# Altium schematic sheet Sheet4.SchDoc
size A4; SheetNumber: 3; SheetTotal: 3
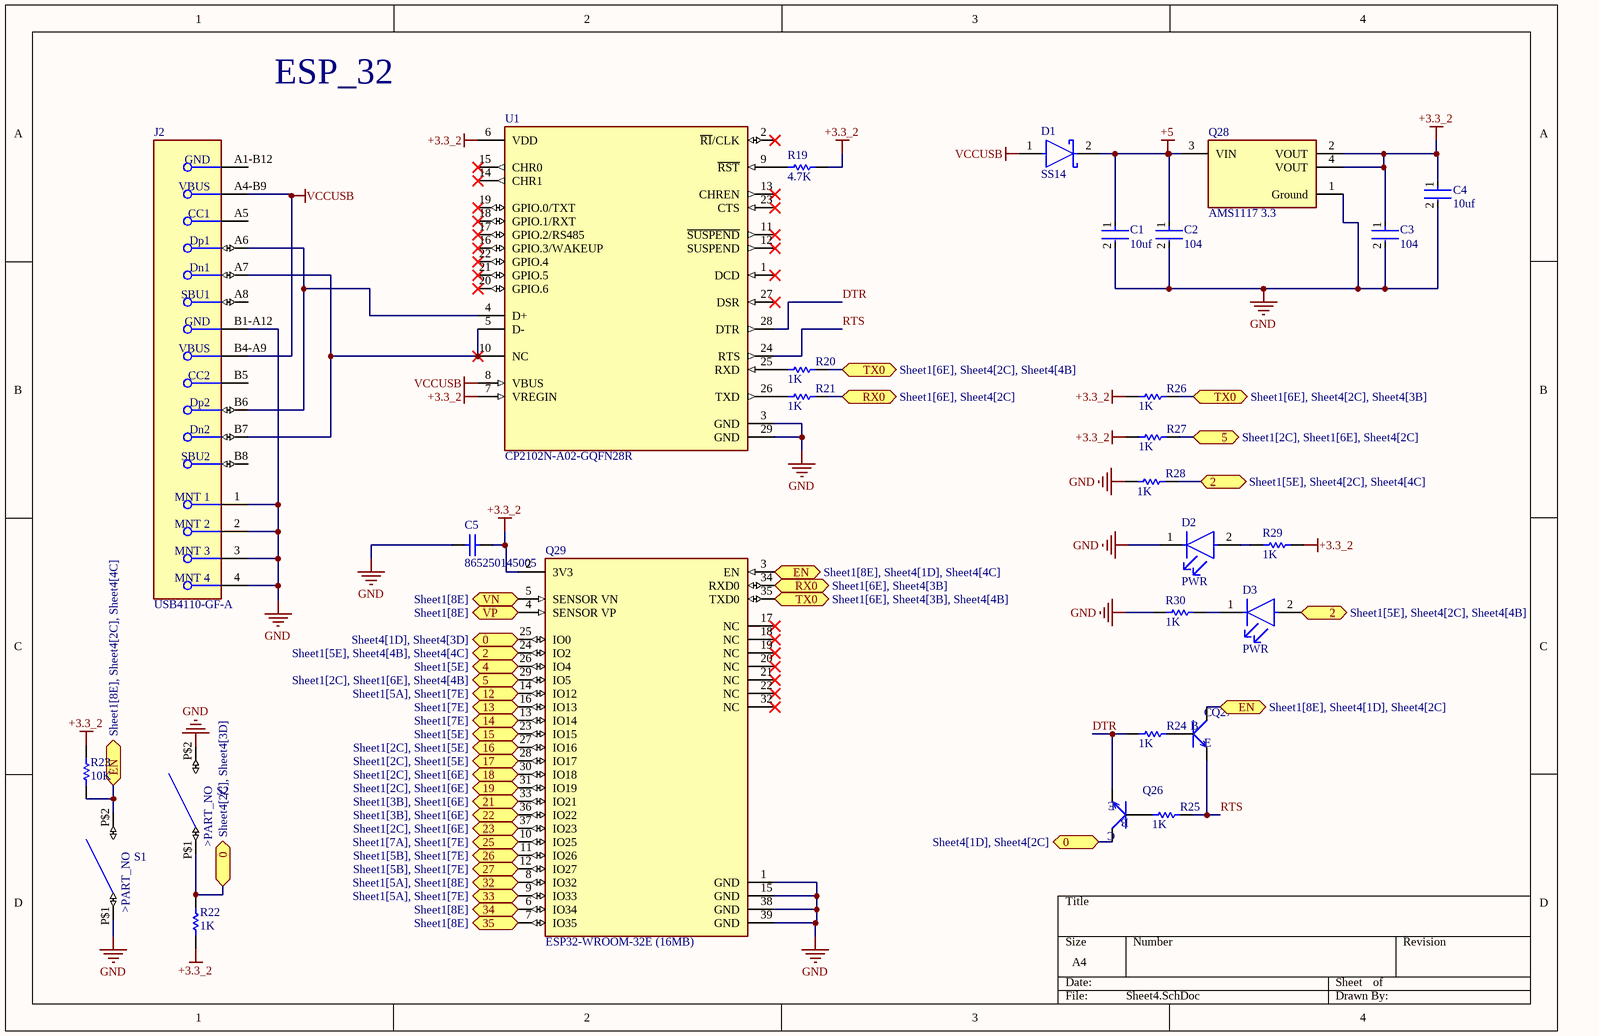
[diagram p0: Sheet4.SchDoc]

## Parts
C1  10uf  [FP-GRM21B-0_1-MFG]
C2  104  [FP-GRM21B-0_1-MFG]
C3  104  [FP-GRM21B-0_1-MFG]
C4  10uf  [FP-GRM21B-0_1-MFG]
C5  865250145005  [WCAP-ASNP_D6.3H7.7]
D1  SS14  [FP-403AE-MFG]
D2  PWR  [FP-KP-2012QBC-D-MFG]
D3  PWR  [FP-KP-2012QBC-D-MFG]
J2  USB4110-GF-A  [FP-USB4110-GF-A-MFG]
Q26  SMD-TRANSISTORS-NPN-25V-500MW(SOT-23)  [SOT-23]  (value not drawn)
Q27  SMD-TRANSISTORS-NPN-25V-500MW(SOT-23)  [SOT-23]  (value not drawn)
Q28  AMS1117 3.3  [FP-AMS1117-IPC_A]
Q29  ESP32-WROOM-32E (16MB)  [FP-ESP32-WROOM-32E_16MB-MFG]
R19  4.7K  [RESC2013X70X40NL20T20]
R20  1K  [RESC2013X70X40NL20T20]
R21  1K  [RESC2013X70X40NL20T20]
R22  1K  [RESC2013X70X40NL20T20]
R23  10K  [RESC2013X70X40NL20T20]
R24  1K  [RESC2013X70X40NL20T20]
R25  1K  [RESC2013X70X40NL20T20]
R26  1K  [RESC2013X70X40NL20T20]
R27  1K  [RESC2013X70X40NL20T20]
R28  1K  [RESC2013X70X40NL20T20]
R29  1K  [RESC2013X70X40NL20T20]
R30  1K  [RESC2013X70X40NL20T20]
S1  PTS636SP43SMTRLFS  [PTS636SP43SMTRLFS]  (value not drawn)
S2  PTS636SP43SMTRLFS  [PTS636SP43SMTRLFS]  (value not drawn)
U1  CP2102N-A02-GQFN28R  [FP-CP2102N-A02-GQFN28R-IPC_B]

## Ports
0 (bidir, see Sheet4[1D], Sheet4[2C]), 0 (bidir, see Sheet4[1D], Sheet4[3D]), 0 (bidir, see Sheet4[2C], Sheet4[3D]), 2 (bidir, see Sheet1[5E], Sheet4[2C], Sheet4[4B]), 2 (bidir, see Sheet1[5E], Sheet4[2C], Sheet4[4C]), 2 (bidir, see Sheet1[5E], Sheet4[4B], Sheet4[4C]), 4 (bidir, see Sheet1[5E]), 5 (bidir, see Sheet1[2C], Sheet1[6E], Sheet4[2C]), 5 (bidir, see Sheet1[2C], Sheet1[6E], Sheet4[4B]), 12 (bidir, see Sheet1[5A], Sheet1[7E]), 13 (bidir, see Sheet1[7E]), 14 (bidir, see Sheet1[7E]), 15 (bidir, see Sheet1[5E]), 16 (bidir, see Sheet1[2C], Sheet1[5E]), 17 (bidir, see Sheet1[2C], Sheet1[5E]), 18 (bidir, see Sheet1[2C], Sheet1[6E]), 19 (bidir, see Sheet1[2C], Sheet1[6E]), 21 (bidir, see Sheet1[3B], Sheet1[6E]), 22 (bidir, see Sheet1[3B], Sheet1[6E]), 23 (bidir, see Sheet1[2C], Sheet1[6E]), 25 (bidir, see Sheet1[7A], Sheet1[7E]), 26 (bidir, see Sheet1[5B], Sheet1[7E]), 27 (bidir, see Sheet1[5B], Sheet1[7E]), 32 (bidir, see Sheet1[5A], Sheet1[8E]), 33 (bidir, see Sheet1[5A], Sheet1[7E]), 34 (bidir, see Sheet1[8E]), 35 (bidir, see Sheet1[8E]), EN (bidir, see Sheet1[8E], Sheet4[1D], Sheet4[2C]), EN (bidir, see Sheet1[8E], Sheet4[1D], Sheet4[4C]), EN (bidir, see Sheet1[8E], Sheet4[2C], Sheet4[4C]), RX0 (bidir, see Sheet1[6E], Sheet4[2C]), RX0 (bidir, see Sheet1[6E], Sheet4[3B]), TX0 (bidir, see Sheet1[6E], Sheet4[2C], Sheet4[3B]), TX0 (bidir, see Sheet1[6E], Sheet4[2C], Sheet4[4B]), TX0 (bidir, see Sheet1[6E], Sheet4[3B], Sheet4[4B]), VN (bidir, see Sheet1[8E]), VP (bidir, see Sheet1[8E])

## Nets
+3.3_2: C3.1 C4.1 C5.2 Q28.2(VOUT) Q28.4(VOUT) Q29.2(3V3) R19.1 R22.2 R23.1 R26.2 R27.2 R29.2 U1.6(VDD) U1.7(VREGIN)
+5: C1.1 C2.1 D1.2(C) Q28.3(VIN)
GND: C1.2 C2.2 C3.2 C4.2 C5.1 D2.1(C) J2.1(MNT_1) J2.2(MNT_2) J2.3(MNT_3) J2.4(MNT_4) J2.B1-A12(GND) Q28.1(Ground) Q29.1(GND) Q29.15(GND) Q29.38(GND) Q29.39(GND) R28.2 R30.1 S1.P$1 S2.P$2 U1.3(GND) U1.29(GND)
VCCUSB: D1.1(A) J2.A4-B9(VBUS) J2.B4-A9(VBUS) U1.8(VBUS)
0: Q26.3(C) Q29.25(IO0) R22.1 S2.P$1 ; port 0
2: D3.2(A) Q29.24(IO2) R28.1 ; port 2
4: Q29.26(IO4) ; port 4
5: Q29.29(IO5) R27.1 ; port 5
12: Q29.14(IO12) ; port 12
13: Q29.16(IO13) ; port 13
14: Q29.13(IO14) ; port 14
15: Q29.23(IO15) ; port 15
16: Q29.27(IO16) ; port 16
17: Q29.28(IO17) ; port 17
18: Q29.30(IO18) ; port 18
19: Q29.31(IO19) ; port 19
21: Q29.33(IO21) ; port 21
22: Q29.36(IO22) ; port 22
23: Q29.37(IO23) ; port 23
25: Q29.10(IO25) ; port 25
26: Q29.11(IO26) ; port 26
27: Q29.12(IO27) ; port 27
32: Q29.8(IO32) ; port 32
33: Q29.9(IO33) ; port 33
34: Q29.6(IO34) ; port 34
35: Q29.7(IO35) ; port 35
DTR: Q26.2(E) R24.2 U1.28(DTR)
EN: Q27.3(C) Q29.3(EN) R23.2 S1.P$2 ; port EN
RTS: Q27.2(E) R25.1 U1.24(RTS)
RX0: Q29.34(RXD0) R21.1 ; port RX0
TX0: Q29.35(TXD0) R20.1 R26.1 ; port TX0
VN: Q29.5(SENSOR_VN) ; port VN
VP: Q29.4(SENSOR_VP) ; port VP
NetD2_2: D2.2(A) R29.1
NetD3_1: D3.1(C) R30.2
NetJ2_A6: J2.A6(Dp1) J2.B6(Dp2) U1.4(D+)
NetJ2_A7: J2.A7(Dn1) J2.B7(Dn2) U1.5(D-) U1.10(NC)
NetQ26_1: Q26.1(B) R25.2
NetQ27_1: Q27.1(B) R24.1
NetR19_2: R19.2 U1.9(~{RST})
NetR20_2: R20.2 U1.25(RXD)
NetR21_2: R21.2 U1.26(TXD)

Not connected (* = marked no-connect by the designer): J2 A1-B12(GND) A5(CC1) A8(SBU1) B5(CC2) B8(SBU2); Q29 17(NC)* 18(NC)* 19(NC)* 20(NC)* 21(NC)* 22(NC)* 32(NC)*; U1 1(DCD)* 2(~{RI}/CLK)* 11(~{SUSPEND})* 12(SUSPEND)* 13(CHREN)* 14(CHR1)* 15(CHR0)* 16(GPIO.3/WAKEUP)* 17(GPIO.2/RS485)* 18(GPIO.1/RXT)* 19(GPIO.0/TXT)* 20(GPIO.6)* 21(GPIO.5)* 22(GPIO.4)* 23(CTS)* 27(DSR)*

## Notes on the sheet
- ESP_32
- (in symbol PTS636SP43SMTRLFS) >PART_NO

## Library data of the parts
C1-C4 = CMP-2007-03453-2: Chip Multilayer Ceramic Capacitors for General Purpose, 0805, 10uF, X5R, 15%, 10%, 16V; Radiation Hardening: No; Thickness: 0.053inch; Voltage Rating (DC): 16V; Lead Free: Lead Free; Package Quantity: 1; Width: 1.25mm; Case Code (Imperial): 0805; Depth: 1.25mm; Packaging: Tape and Reel; Dielectric: X5R; Max Operating Temperature: 85°C; Tolerance: 10%; Voltage Rating: 16V; Voltage: 16V; Capacitance: 10uF; Height: 1.25mm; Case Code (Metric): 2012; Material: Ceramic; Mount: Surface Mount; Case/Package: 0805; REACH SVHC: No SVHC; Length: 2mm; Min Operating Temperature: -55°C; Termination: SMD/SMT
C5 = CMP-03913-53758703-1: 865250145005 SMD Aluminium Electrolytic Capacitor, WCAP-ASNP Series, 100 F, 6.3 V, Radial Can - SMD, 6.3 mm; Impedance: 463.097mΩ; Ripple Current (AC): 65mA; Life (Hours): 2000hours; Voltage Rating: 6.3V; Insulation Resistance: 1MΩ; Tolerance: 20%; Capacitance: 100µF; Polarity: Polar; Leakage Current: 31.5µA; Width: 6.6mm; Height - Seated (Max): 7.6962mm; RoHS: Compliant; REACH SVHC: Unknown; Length: 7.7mm; Max Operating Temperature: 85°C; Case/Package: Radial; Diameter: 6.3mm; NexarPartId: 53758703; Min Operating Temperature: -40°C; Ripple Current: 65mA; Mount: Surface Mount; Packaging: Tape & Reel (TR); Voltage Rating (DC): 6.3V; Height: 7.7mm
D1 = CMP-2000-04943-2: DIODE SCHOTTKY 40V 1A SMA; Manufacturer: ON Semiconductor; Peak Reverse Current: 0.2mA; Max Junction Temp: +125°C; Standoff Height: 0.05mm; Max Surge Forward Current: 40A; Mouser Description: Schottky Diodes & Rectifiers SMA 40V 1.0A; RoHS: TRUE; Lead Free: Yes; Manufacturer Part Number: SS14; Device Class L3: Schottky Diodes; Category: Diode; Automotive: No; Digikey Description: DIODE SCHOTTKY 40V 1A SMA; ComponentLink2Description: Datasheet; Device Class L2: Diodes; Height: 2.5mm; Temperature Range High: +125°C; ComponentLink2URL: https://www.onsemi.com/pub/Collateral/SS19-D.PDF; Device Class L1: Discrete Semiconductors; Package: 403AE; Octopart: https://octopart.com/ss14-on+semiconductor-29205033; Max Repetitive Reverse Voltage: 40V; Temperature Range Low: -65°C; Forward Current: 1A; Temperature: -65°C to +125°C
D2 D3 = CMP-44529-000058-1: LED, Low Power, Blue, SMD, 0805 [2012 Metric], 20 mA, 3.3 V, 465 nm; Wavelength: 465nm; Lens Color: Clear; Number of LEDs: 1; Viewing Angle: 120°; Luminous Intensity: 100mcd; Dominant Wavelength: 470nm; Forward Voltage: 3.3V; Lens Style: Diffused; Forward Current: 20mA; Color: Blue; Packaging: Tape and Reel; Width: 2mm; Number of Pins: 2; Radiation Hardening: No; Series: KP; Length: 1.25mm; REACH SVHC: No SVHC; Case/Package: 2012; Mount: Surface Mount; Height: 1.1mm; RoHS Compliant: Yes
J2 = CMP-245163-000002-1: CONN USB 2.0 TYPE-C R/A SMT; Manufacturer: GCT; Conn Orientation: Right Angle; Usb Standard: USB 2.0; Voltage Rating: 20V; Current Rating: 3/4.25/1.25/0.25A; Number Of Contacts: 16; Is Female: yes; Shielding: true; Standoff Height: 0.1mm; Octopart: https://octopart.com/usb4110-gf-a-gct-103941985; Temperature: -40°C to +85°C; RoHS: TRUE; Automotive: No; Contact Material: Gold,Nickel; Device Class L1: Connectors; Device Class L2: USB Connectors; Package: 0; Lead Free: Yes; ComponentLink2URL: https://gct.co/files/drawings/usb4110.pdf; Temperature Range High: +85°C; Temperature Range Low: -40°C; Height: 3.46mm; Manufacturer Part Number: USB4110-GF-A; ComponentLink2Description: Datasheet; Device Class L3: unset; Digikey Description: CONN USB 2.0 TYPE-C R/A SMT; Category: Conn
Q26 Q27 = SMD-TRANSISTORS-NPN-25V-500MW(SOT-23): Bipolar (BJT) Transistor NPN 25 V 500 mA 150MHz 300 mW Surface Mount SOT-23; MF: UMW; MP: S8050; Purchase-URL: https://pricing.snapeda.com/search/part/S8050/?ref=eda; Check_prices: https://www.snapeda.com/parts/S8050/Umwelt+Sensor+Teknik/view-part/?ref=eda; SnapEDA_Link: https://www.snapeda.com/parts/S8050/Umwelt+Sensor+Teknik/view-part/?ref=snap; Price: None; Availability: In Stock; Package: None; Value: *
Q28 = CMP-209535-000001-1: LDO Voltage Regulators 1A, 3.3V; Manufacturer Part Number: AMS1117-3.3; Manufacturer: Advanced Monolithic Systems; Dropout Voltage: 1.1V; Output Type: Fixed; Nominal Supply Current: 5mA; Max Power Dissipation: 1.2W; Max Supply Voltage: 15V; Number Of Outputs: 1; Standoff Height: 0.64mm; Max Junction Temp: +125°C; Height: 1.8mm; Package: AMS1117; Device Class L2: Power Management ICs; ComponentLink2Description: Datasheet; ComponentLink2URL: http://www.advanced-monolithic.com/pdf/ds1117.pdf; Category: IC; RoHS: TRUE; Automotive: No; Device Class L1: Integrated Circuits (ICs); Output Current: 1A; Device Class L3: Voltage Regulators - Linear; Temperature: -40°C to +125°C; Output Voltage: 3.3V; Temperature Range Low: -40°C; Octopart: https://octopart.com/ams1117-3.3-advanced+monolithic+systems-25899300; Lead Free: Yes; Ipc Land Pattern Name: SOT229P700X180-4; Temperature Range High: +125°C
Q29 = CMP-194065-000027-1: RX TXRX MOD WIFI TRACE ANT SMD
R19-R30 = CMP-2001-04376-1: Manufacturer: Panasonic; Part Number: ERJ-6ENF1002V
S1 S2 = PTS636SP43SMTRLFS: MF: C&K Components; Package: None; Price: None; Value: *; SnapEDA_Link: https://www.snapeda.com/parts/PTS636SP43SMTRLFS/C%2526K+Components/view-part/?ref=snap; MP: PTS636SP43SMTRLFS; Availability: In Stock; Check_prices: https://www.snapeda.com/parts/PTS636SP43SMTRLFS/C%2526K+Components/view-part/?ref=eda
U1 = CMP-08093-000007-1: IC USB TO UART BRIDGE QFN28